# Altium schematic sheet 03_USART.SchDoc
size A4; PageSetup: Record=PageOptions|CenterHorizontal=True|CenterVertical=True|PrintScale=0.97|XCorrection=1.00|YCorrection=1.00|PrintKind=0|BorderSize=5000000|LeftOffset=0|BottomOffset=0|Orientation=2|PaperLength=1000|PaperWidth=1000|Scale=100|PaperSource=7|PrintQuality=-4|MediaType=1|DitherType=10|PaperKind=A4|PrintScaleMode=1
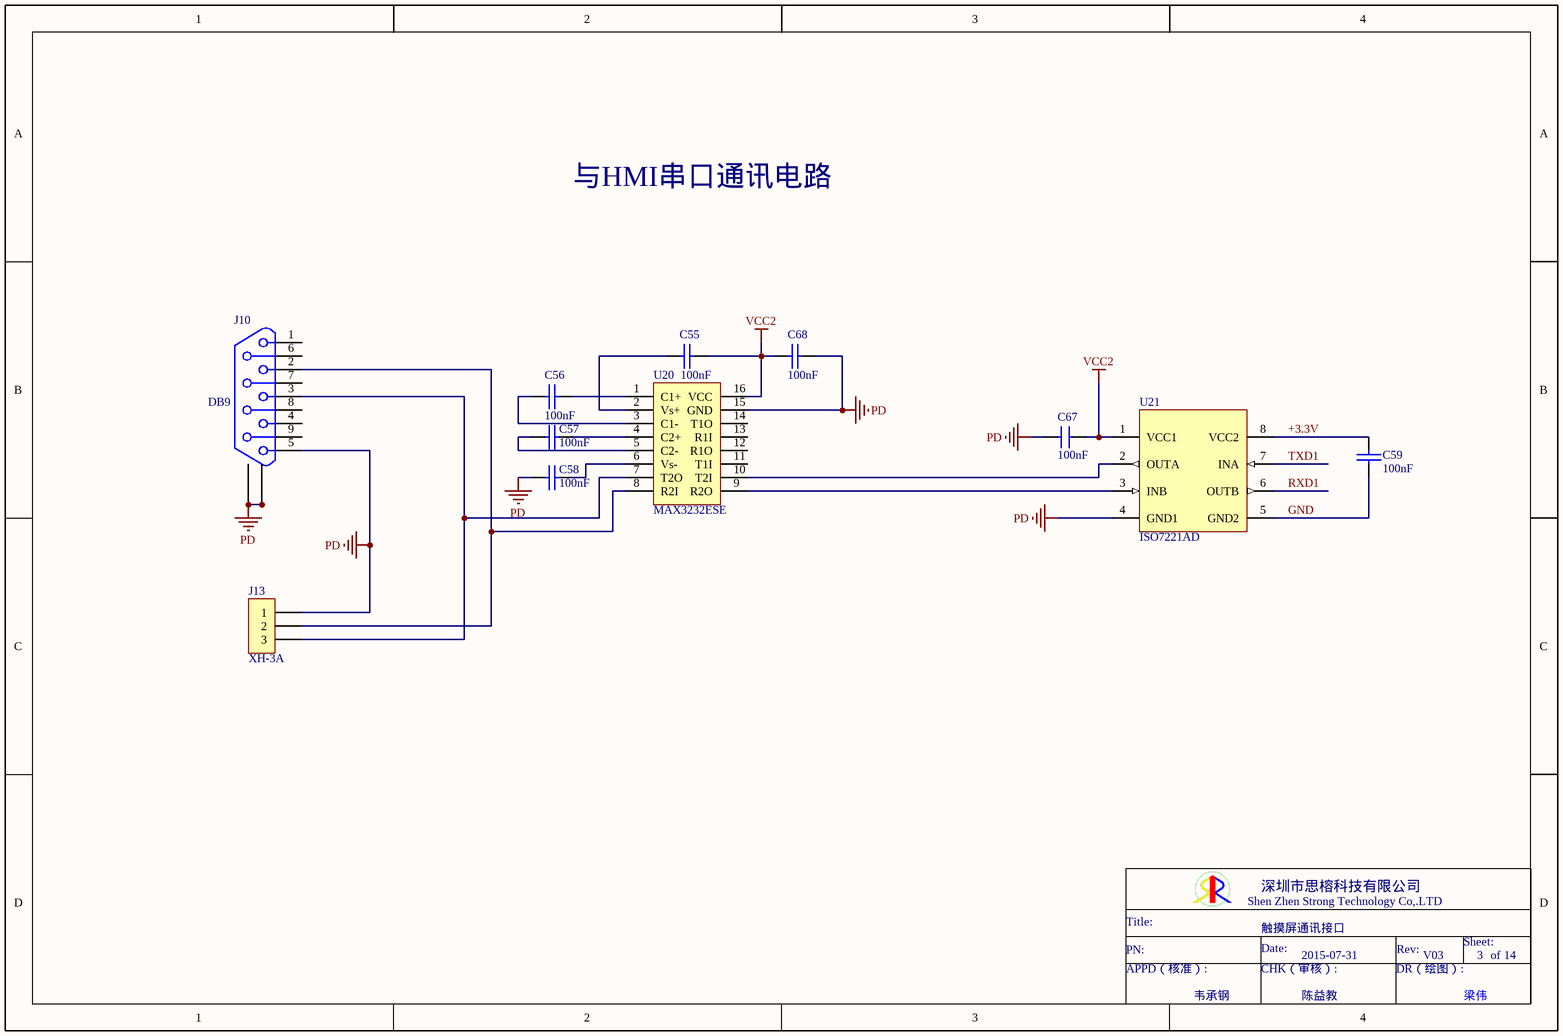
[diagram p0: 03_USART.SchDoc]

## Parts
C55  100nF  [0603C]
C56  100nF  [0603C]
C57  100nF  [0603C]
C58  100nF  [0603C]
C59  100nF  [0603C]
C67  100nF  [0603C]
C68  100nF  [0603C]
J10  DB9  [DSUB1.385]
J13  XH-3A  [CN3-2.54]
U20  MAX3232ESE  [SO-16]
U21  ISO7221AD  [SOP8]

## Nets
PD: C58.1 C67.1 C68.1 J10.5 J10.10 J10.11 J13.1 U20.15(GND) U21.4(GND1)
VCC2: C55.2 C67.2 C68.2 U20.16(VCC) U21.1(VCC1)
+3.3V: C59.2 U21.8(VCC2)
GND: C59.1 U21.5(GND2)
RXD1: U21.6(OUTB)
TXD1: U21.7(INA)
NetC55_1: C55.1 U20.2(Vs+)
NetC56_1: C56.1 U20.1(C1+)
NetC56_2: C56.2 U20.3(C1-)
NetC57_1: C57.1 U20.5(C2-)
NetC57_2: C57.2 U20.4(C2+)
NetC58_2: C58.2 U20.6(Vs-)
NetJ10_2: J10.2 J13.2 U20.8(R2I)
NetJ10_3: J10.3 J13.3 U20.7(T2O)
NetU20_9: U20.9(R2O) U21.3(INB)
NetU20_10: U20.10(T2I) U21.2(OUTA)

Not connected (* = marked no-connect by the designer): J10 1 4 6 7 8 9; U20 11(T1I) 12(R1O) 13(R1I) 14(T1O)

## Notes on the sheet
- 与HMI串口通讯电路
- 触摸屏通讯接口
- 2015-07-31
- V03
- 3
- 14
- 韦承钢
- 陈益教
- Shen Zhen Strong Technology Co,.LTD
- 深圳市思榕科技有限公司
- Title:
- PN:
- APPD（核准）:
- Date:
- CHK（审核）:
- DR（绘图）:
- Rev:
- Sheet:
- of
- 梁伟

## Library data of the parts
C55-C59 C68 = CAP
C67 = 电容: Capacitor; C318: 100NF
J13 = CON3
U20 = MAX232
U21 = Component_1